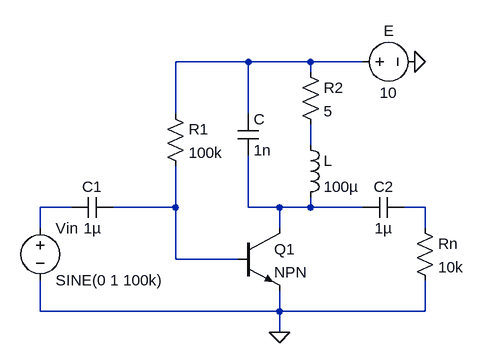
[diagram p0: schematic Draft2.asc]
Draft2.asc, the LTspice schematic file:
Version 4
SHEET 1 880 680
WIRE 320 -48 208 -48
WIRE 416 -48 320 -48
WIRE 496 -48 416 -48
WIRE 416 -32 416 -48
WIRE 208 32 208 -48
WIRE 320 32 320 -48
WIRE 416 80 416 48
WIRE 48 176 0 176
WIRE 208 176 208 112
WIRE 208 176 112 176
WIRE 320 176 320 96
WIRE 368 176 320 176
WIRE 416 176 416 160
WIRE 416 176 368 176
WIRE 496 176 416 176
WIRE 592 176 560 176
WIRE 0 208 0 176
WIRE 368 208 368 176
WIRE 592 208 592 176
WIRE 208 256 208 176
WIRE 304 256 208 256
WIRE 0 336 0 288
WIRE 368 336 368 304
WIRE 368 336 0 336
WIRE 592 336 592 288
WIRE 592 336 368 336
WIRE 368 368 368 336
FLAG 576 -48 0
FLAG 368 368 0
SYMBOL cap 112 160 R90
WINDOW 0 0 32 VBottom 2
WINDOW 3 32 32 VTop 2
SYMATTR InstName C1
SYMATTR Value 1µ
SYMBOL res 192 16 R0
SYMATTR InstName R1
SYMATTR Value 100k
SYMBOL cap 304 32 R0
SYMATTR InstName C
SYMATTR Value 1n
SYMBOL res 400 -48 R0
SYMATTR InstName R2
SYMATTR Value 5
SYMBOL ind 400 64 R0
SYMATTR InstName L
SYMATTR Value 100µ
SYMBOL npn 304 208 R0
SYMATTR InstName Q1
SYMBOL voltage 480 -48 R270
WINDOW 0 32 56 VTop 2
WINDOW 3 -32 56 VBottom 2
SYMATTR InstName E
SYMATTR Value 10
SYMBOL voltage 0 192 R0
WINDOW 123 0 0 Left 0
WINDOW 39 0 0 Left 0
SYMATTR InstName Vin
SYMATTR Value SINE(0 1 100k)
SYMBOL cap 560 160 R90
WINDOW 0 0 32 VBottom 2
WINDOW 3 32 32 VTop 2
SYMATTR InstName C2
SYMATTR Value 1µ
SYMBOL res 576 192 R0
SYMATTR InstName Rn
SYMATTR Value 10k

The netlist it stands for:
* Draft2.asc
C1 N004 N003 1µ
R1 N001 N004 100k
C N001 N005 1n
R2 N001 N002 5
L N002 N005 100µ
Q1 N005 N004 0 0 NPN
V§E N001 0 10
Vin N003 0 SINE(0 1 100k)
C2 N006 N005 1µ
Rn N006 0 10k
.model NPN NPN
.model PNP PNP
.lib standard.bjt
.backanno
.end